# EasyEDA Pro project rp.eprj

# Schematic Schematic1
Board Name: Board1; Create Date: 2026-03-16; Page Name: P1; Project Name: rp; Schematic Name: Schematic1; Update Date: 2026-03-19; Company: EasyEDA.com; Page Size: A4; Version: V1.0
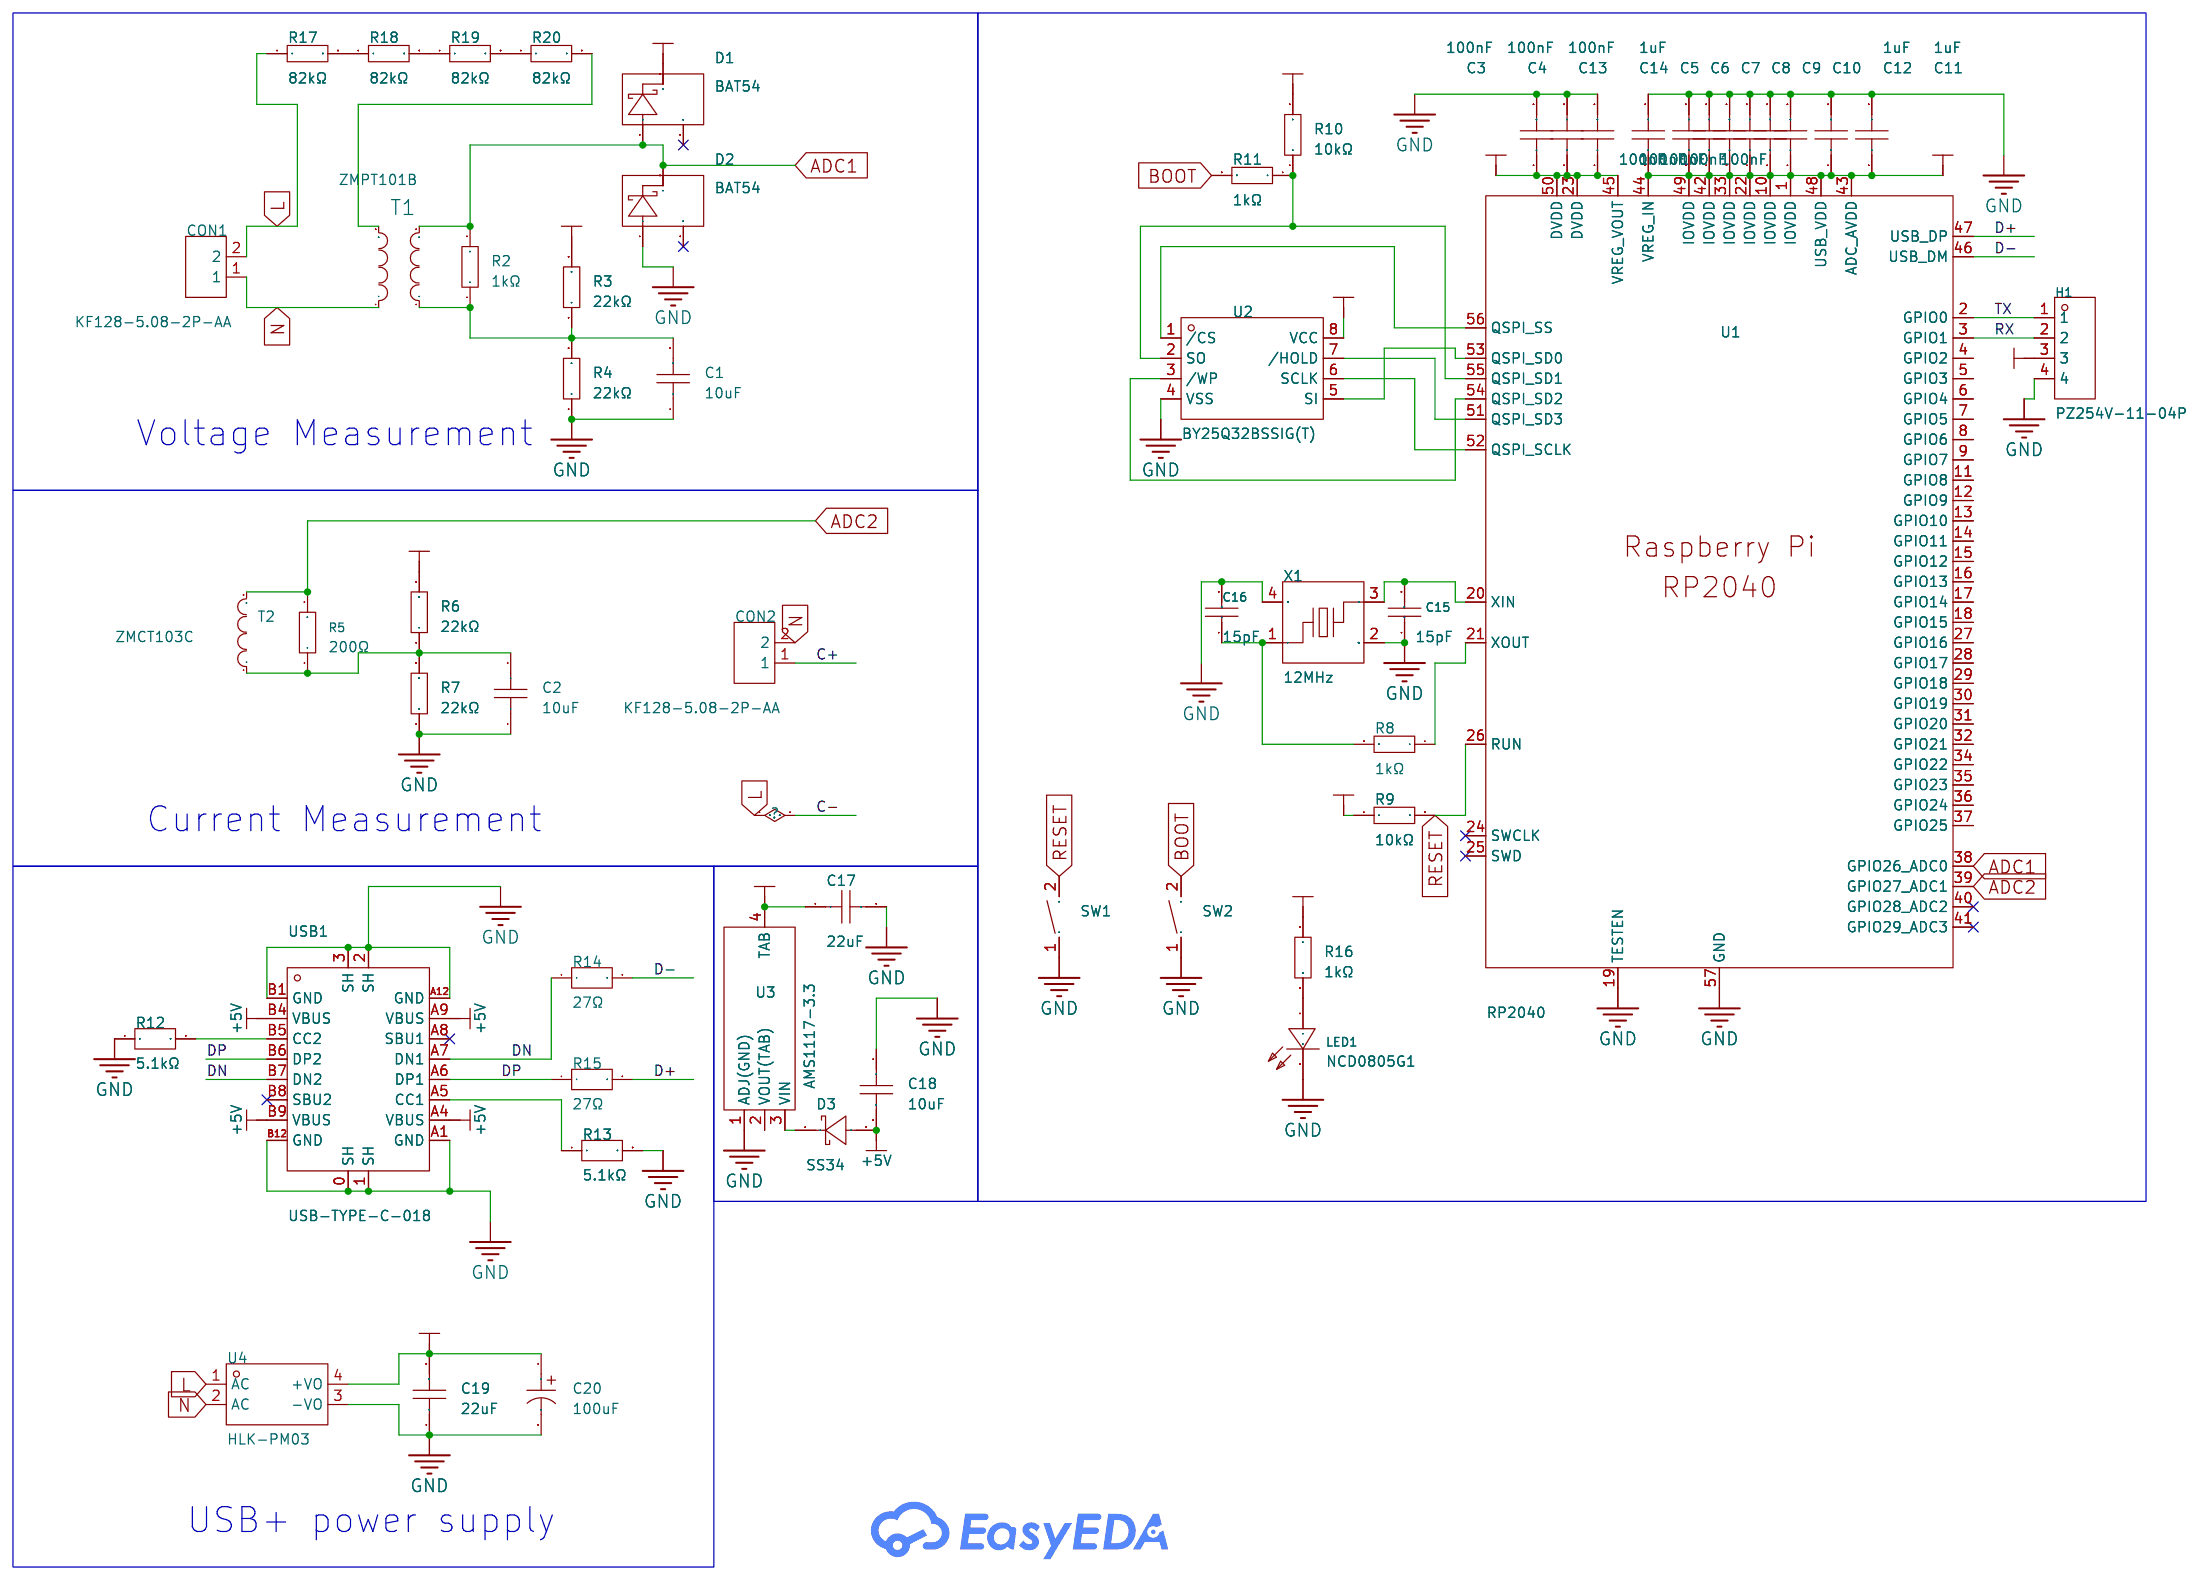
[diagram p0: schematic sheet]

## Parts
C1  10uF  [C0805]
C2  10uF  [C0805]
C3  100nF  [C0603]
C4  100nF  [C0603]
C5  100nF  [C0603]
C6  100nF  [C0603]
C7  100nF  [C0603]
C8  100nF  [C0603]
C9  100nF  [C0603]
C10  100nF  [C0603]
C11  1uF  [C0603]
C12  1uF  [C0603]
C13  100nF  [C0603]
C14  1uF  [C0603]
C15  15pF  [C0603]
C16  15pF  [C0603]
C17  22uF  [C0805]
C18  10uF  [C0805]
C19  22uF  [C0805]
C20  100uF  [CAP-SMD_BD6.3-L6.6-W6.6-LS7.2-FD-1]
CON1  KF128-5.08-2P-AA  [CONN-TH_P5.08_KF128-5.08-2P]
CON2  KF128-5.08-2P-AA  [CONN-TH_P5.08_KF128-5.08-2P]
D1  BAT54  [SOT-23-3_L2.9-W1.4-P1.90-LS2.5-BR]
D2  BAT54  [SOT-23-3_L2.9-W1.4-P1.90-LS2.5-BR]
D3  SS34  [SMA-SMD_L4.4-W2.7-LS5.4-RD]
H1  PZ254V-11-04P  [HDR-TH_4P-P2.54-V-M]
LED1  NCD0805G1  [LED0805-R-RD]
R2  1kΩ  [R0603]
R3  22kΩ  [R0603]
R4  22kΩ  [R0603]
R5  200Ω  [R0805]
R6  22kΩ  [R0603]
R7  22kΩ  [R0603]
R8  1kΩ  [R0603]
R9  10kΩ  [R0603]
R10  10kΩ  [R0603]
R11  1kΩ  [R0603]
R12  5.1kΩ  [R0603]
R13  5.1kΩ  [R0603]
R14  27Ω  [R0603]
R15  27Ω  [R0603]
R16  1kΩ  [R0603]
R17  82kΩ  [R0805]
R18  82kΩ  [R0805]
R19  82kΩ  [R0805]
R20  82kΩ  [R0805]
SW1  HX 3x4x2-2P-1.6N TACTILE SWITCH  [KEY-SMD_L4.0-W3.0-LS4.9-1]
SW2  HX 3x4x2-2P-1.6N TACTILE SWITCH  [KEY-SMD_L4.0-W3.0-LS4.9-1]
T1  ZMPT101B  [XFMR-TH_ZMPT101B]
T2  ZMCT103C  [XFMR-TH_ZMCT103C]
U1  RP2040  [LQFN-56_L7.0-W7.0-P0.4-EP]
U2  BY25Q32BSSIG(T)  [SOP-8_L5.3-W5.3-P1.27-LS8.0-BL]
U3  AMS1117-3.3  [SOT-223-4_L6.5-W3.5-P2.30-LS7.0-BR]
U4  HLK-PM03  [PWRM-TH_HLK-PM03]
USB1  USB-TYPE-C-018  [USB-C_SMD-TYPE-C-31-M-12]
X1  12MHz  [CRYSTAL-SMD_4P-L3.2-W2.5-BL]

## Library data of the parts
C1 C2 C18 = GRM21BR61H106KE43L: LCSC Part Name: 10uF ±10% 50V; Supplier Part: C440198; Manufacturer: muRata(村田); Supplier Footprint: 0805; JLCPCB Part Class: Basic Part; Datasheet: https://item.szlcsc.com/datasheet/GRM21BR61H106KE43L/439567.html; Supplier: LCSC; Tolerance: ±10%; Voltage Rating: 50V; Temperature Coefficient: X5R
C3-C10 C13 = CC0603KRX7R9BB104: LCSC Part Name: 100nF ±10% 50V; Supplier Part: C14663; Manufacturer: YAGEO(国巨); Supplier Footprint: 0603; JLCPCB Part Class: Basic Part; Datasheet: https://item.szlcsc.com/datasheet/CC0603KRX7R9BB104/15331.html; Supplier: LCSC; Tolerance: ±10%; Voltage Rating: 50V; Temperature Coefficient: X7R
C11 C12 C14 = CL10A105KB8NNNC: LCSC Part Name: 1uF ±10% 50V; Supplier Part: C15849; Manufacturer: SAMSUNG(三星); Supplier Footprint: 0603; JLCPCB Part Class: Basic Part; Datasheet: https://item.szlcsc.com/datasheet/CL10A105KB8NNNC/16531.html; Supplier: LCSC; Tolerance: ±10%; Voltage Rating: 50V; Temperature Coefficient: X5R
C15 C16 = CC0603JRNPO9BN150: LCSC Part Name: 15pF ±5% 50V; Supplier Part: C107037; Manufacturer: YAGEO(国巨); Supplier Footprint: 0603; JLCPCB Part Class: Extended Part; Datasheet: https://item.szlcsc.com/datasheet/CC0603JRNPO9BN150/108253.html; Supplier: LCSC; Tolerance: ±5%; Voltage Rating: 50V; Temperature Coefficient: NP0
C17 C19 = CL21A226MAYNNNE: LCSC Part Name: 22uF ±20% 25V; Supplier Part: C602037; Manufacturer: SAMSUNG(三星); Supplier Footprint: 0805; JLCPCB Part Class: Extended Part; Datasheet: https://item.szlcsc.com/datasheet/CL21A226MAYNNNE/631473.html; Supplier: LCSC; Tolerance: ±20%; Voltage Rating: 25V; Temperature Coefficient: X5R
C20 = RVT1E101M0607 100UF 25V: LCSC Part Name: 100uF ±20% 25V; Supplier Part: C970685; Manufacturer: DMBJ(振宝佳); Supplier Footprint: SMD,D6.3xL7.7mm; JLCPCB Part Class: Extended Part; Datasheet: https://item.szlcsc.com/datasheet/RVT1E101M0607%2520100UF%252025V/1060413.html; Supplier: LCSC; Tolerance: ±20%; Voltage Rating: 25V; Ripple Current: 93mA@120Hz; Diameter: 6.3mm; Height - Seated (Max): 7.7mm; Lifetime: 2800hrs@105℃; Operating Temperature: -55℃~+105℃
CON1 CON2 = KF128-5.08-2P-AA: LCSC Part Name: 5.08mm 1x2P 排数:1 每排P数:2 直插; Supplier Part: C474952; Manufacturer: KEFA(科发); Supplier Footprint: 插件,P=5.08mm; JLCPCB Part Class: Extended Part; Datasheet: https://item.szlcsc.com/datasheet/KF128-5.08-2P-AA/481570.html; Supplier: LCSC; Number of Positions or Pins: 1x2P; Pitch: 5.08mm; Color: Green; Mounting Type: Straight; Number of Pins: 2P; Number of Rows: 1; Number of PINs Per Row: 2; Current Rating: 24A; Voltage Rating (Max): 250V; Wire Gauge - AWG: 12~22; Wire Gauge - mm2: 2.5; Operating Temperature: -40℃~+105℃
D1 D2 = BAT54_C22466368: LCSC Part Name: 电压:30V 电流:0.2A; Supplier Part: C22466368; Manufacturer: R+O(宏嘉诚); Supplier Footprint: SOT-23; JLCPCB Part Class: Extended Part; Datasheet: https://item.szlcsc.com/datasheet/BAT54/24165527.html; Supplier: LCSC; Diode Configuration: Independent; Voltage - Forward(Vf@If): 1V@100mA; Voltage - DC Reverse(Vr): 30V; Current - Rectified: 200mA; Reverse Leakage Current (Ir): 2uA@25V; Non-Repetitive Peak Forward Surge Current: 600mA
D3 = SS34_C22448055: LCSC Part Name: 电压:40V 电流:3A; Supplier Part: C22448055; Manufacturer: XUMAO(旭茂微); Supplier Footprint: SMA; JLCPCB Part Class: Extended Part; Datasheet: https://item.szlcsc.com/datasheet/SS34/24106939.html; Supplier: LCSC; Voltage - Forward(Vf@If): 550mV@3A; Voltage - DC Reverse(Vr): 40V; Current - Rectified: 3A; Reverse Leakage Current (Ir): 100uA@40V; Operating Junction Temperature Range: -55℃~+150℃
H1 = PZ254V-11-04P: LCSC Part Name: 1x4P 间距:2.54mm 方针 直插; Supplier Part: C2691448; Manufacturer: XFCN(兴飞); Supplier Footprint: 插件,P=2.54mm; JLCPCB Part Class: Extended Part; Datasheet: https://item.szlcsc.com/datasheet/PZ254V-11-04P/2801085.html; Supplier: LCSC; Pin Structure: 1x4P; Pitch: 2.54mm; Circluar Pins/Square Pins: Pin Header; Mounting Type: Through Hole; Number of Rows: 1; Number of Pins: 4P; Current Rating: 3A; Voltage Rating (Max): 250V; Length of Mating Pin: 6mm; Insulation Height: 2.5mm; Length of End Connection Pin: 3mm; Operating Temperature: -40℃~+105℃; Color: Black
LED1 = NCD0805G1: LCSC Part Name: 片式发光二极管; Supplier Part: C84260; Manufacturer: 国星光电; Supplier Footprint: 0805; JLCPCB Part Class: Extended Part; Datasheet: https://item.szlcsc.com/datasheet/NCD0805G1/85429.html; Supplier: LCSC; Illumination Color: Green; Voltage - Forward(Vf): 2.5V~3.6V; Power(Watts): 72mW; Forward Current: 20mA; Wavelength - Dominant: 525nm~537.5nm; Peak Wavelength: 520nm; Diode Configuration: Discrete Diode; Luminous Intensity: 400mcd; Viewing Angle: 130°; Operating Temperature: -30℃~+85℃
R2 R8 R11 R16 = RC0603FR-071KL: LCSC Part Name: 厚膜电阻 1kΩ ±1% 100mW; Supplier Part: C22548; Manufacturer: YAGEO(国巨); Supplier Footprint: 0603; JLCPCB Part Class: Extended Part; Datasheet: https://item.szlcsc.com/datasheet/RC0603FR-071KL/23274.html; Supplier: LCSC; Type: Thick Film Resistor; Tolerance: ±1%; Power(Watts): 100mW; Voltage-Supply(Max): 75V; Temperature Coefficient: ±100ppm/℃; Operating Temperature: -55℃~+155℃
R3 R4 R6 R7 = RC0603FR-0722KL: LCSC Part Name: 厚膜电阻 22kΩ ±1% 100mW; Supplier Part: C114065; Manufacturer: YAGEO(国巨); Supplier Footprint: 0603; JLCPCB Part Class: Extended Part; Datasheet: https://item.szlcsc.com/datasheet/RC0603FR-0722KL/115304.html; Supplier: LCSC; Type: Thick Film Resistor; Tolerance: ±1%; Power(Watts): 100mW; Voltage-Supply(Max): 75V; Temperature Coefficient: ±100ppm/℃; Operating Temperature: -55℃~+155℃
R5 = 0805W8F2000T5E: LCSC Part Name: 200Ω ±1% 125mW 厚膜电阻; Supplier Part: C17540; Manufacturer: UNI-ROYAL(厚声); Supplier Footprint: 0805; JLCPCB Part Class: Basic Part; Datasheet: https://item.szlcsc.com/datasheet/0805W8F2000T5E/18228.html; Supplier: LCSC; Type: Thick Film Resistor; Tolerance: ±1%; Power(Watts): 125mW; Voltage-Supply(Max): 150V; Temperature Coefficient: ±100ppm/℃; Operating Temperature: -55℃~+155℃
R9 R10 = RC0603FR-0710KL: LCSC Part Name: 厚膜电阻 10kΩ ±1% 100mW; Supplier Part: C98220; Manufacturer: YAGEO(国巨); Supplier Footprint: 0603; JLCPCB Part Class: Extended Part; Datasheet: https://atta.szlcsc.com/upload/public/pdf/source/20180927/C295883_E8D83085EA81BD7DE0B2B681138C15EE.pdf; Supplier: LCSC; Type: Thick Film Resistors; Tolerance: ±1%; Temperature Coefficient: ±100ppm/℃; Operating Temperature Range: -55℃~+155℃
R12 R13 = FRC0603F5101TS: LCSC Part Name: 5.1kΩ ±1% 100mW 厚膜电阻; Supplier Part: C2907044; Manufacturer: FOJAN(富捷); Supplier Footprint: 0603; JLCPCB Part Class: Extended Part; Supplier: LCSC; Type: Thick Film Resistor; Tolerance: ±1%; Power(Watts): 100mW; Voltage-Supply(Max): 75V; Temperature Coefficient: ±100ppm/℃; Operating Temperature: -55℃~+155℃
R14 R15 = FRC0603F27R0TS: LCSC Part Name: 27Ω ±1% 100mW 厚膜电阻; Supplier Part: C2907021; Manufacturer: FOJAN(富捷); Supplier Footprint: 0603; JLCPCB Part Class: Extended Part; Supplier: LCSC; Type: Thick Film Resistor; Tolerance: ±1%; Power(Watts): 100mW; Voltage-Supply(Max): 75V; Temperature Coefficient: ±100ppm/℃; Operating Temperature: -55℃~+155℃
R17-R20 = 0805W8F8202T5E: LCSC Part Name: 82kΩ ±1% 125mW 厚膜电阻; Supplier Part: C17840; Manufacturer: UNI-ROYAL(厚声); Supplier Footprint: 0805; JLCPCB Part Class: Extended Part; Datasheet: https://item.szlcsc.com/datasheet/0805W8F8202T5E/18528.html; Supplier: LCSC; Type: Thick Film Resistor; Tolerance: ±1%; Power(Watts): 125mW; Voltage-Supply(Max): 150V; Temperature Coefficient: ±100ppm/℃; Operating Temperature: -55℃~+155℃
SW1 SW2 = HX 3x4x2-2P-1.6N TACTILE SWITCH: LCSC Part Name: 4*3*2mm 立贴 轻触开关; Supplier Part: C49234124; Manufacturer: hanxia(韩下); Supplier Footprint: SMD; JLCPCB Part Class: Extended Part; Datasheet: https://item.szlcsc.com/datasheet/HX%25203x4x2-2P-1.6N%2520TACTILE%2520SWITCH/51650185.html; Supplier: LCSC; Circuit: SPST; Actuator Style: Round Button; Operating Force: 1.6N; Mounting Type: Surface Mount,Vertical; Length: 4mm; Width: 3mm; Switch Height: 2mm; with Bracket: Without Bracket; Contact Current: 50mA; Voltage Rating: 12V; Actuator/Cap Color: Black; With Lamp: No; Termination Style: SMD(SMT) Tab; Life: 100,000 Cycles
T1 = ZMPT101B: Supplier Part: C111858; Manufacturer: 择明朗熙; Supplier Footprint: 插件; JLCPCB Part Class: Extended Part; Datasheet: https://item.szlcsc.com/datasheet/ZMPT101B/113087.html; Supplier: LCSC
T2 = ZMCT103C: LCSC Part Name: 蓝色 A类 精密电流互感器; Supplier Part: C94571; Manufacturer: 择明朗熙; Supplier Footprint: 插件; JLCPCB Part Class: Extended Part; Datasheet: https://item.szlcsc.com/datasheet/ZMCT103C/95769.html; Supplier: LCSC; Type: Current Transformer; Turns Ratio: 1000:1; Rated input Current: 5A; Rated Output Current: 5mA; Linearity: 0.2%; Isolation Voltage(Vrms): 4.5kV
U1 = RP2040_C2040: LCSC Part Name: RP2040（RP2B2）; Supplier Part: C2040; Manufacturer: Raspberry Pi(树莓派); Supplier Footprint: LQFN-56(7x7); JLCPCB Part Class: Extended Part; Datasheet: https://item.szlcsc.com/datasheet/RP2040/2392.html; Supplier: LCSC; CPU Maximum Speed: 133MHz; Number of I/O: 30; ADC (Bit): 12bit
U2 = BY25Q32BSSIG(T): LCSC Part Name: 停产 32Mbit SPI NOR闪存; Supplier Part: C428875; Manufacturer: BOYAMICRO(博雅); Supplier Footprint: SOP-8-208mil; JLCPCB Part Class: Extended Part; Datasheet: https://item.szlcsc.com/datasheet/BY25Q32BSSIG(T)/424013.html; Supplier: LCSC; Interface: SPI; Memory Size: 32Mbit; Clock Frequency: 120MHz; Voltage - Supply: 2.7V~3.6V; Standby Supply Current: 5uA; Program / Erase Cycles: 100,000 Cycles; Page Programming Time (Tpp): 600us; Block Erase Time(tBE): 150ms@(32KB); Data Retention - TDR (Year): 20 Years; Operating Temperature: -40℃~+85℃
U3 = AMS1117-3.3_C347222: LCSC Part Name: 3.3V 1A 12V; Supplier Part: C347222; Manufacturer: UMW(友台半导体); Supplier Footprint: SOT-223; JLCPCB Part Class: Extended Part; Datasheet: https://item.szlcsc.com/datasheet/AMS1117-3.3/323882.html; Supplier: LCSC; Output Type: Fixed; Voltage - Supply: 12V; Output Voltage: 3.3V; Output Current: 1A; Power Supply Rejection Ratio (PSRR): 60dB@(120Hz); Voltage Dropout: 1.3V@(1A); standby current: 5mA; Noise: 0.003%Vout; Features: Over Current Protection; Operating Temperature: -40℃~+125℃; Output Configuration: Positive; Number of Outputs: 1
U4 = HLK-PM03: Supplier Part: C209904; Manufacturer: HI-LINK(海凌科); Supplier Footprint: 插件; JLCPCB Part Class: Extended Part; Datasheet: https://atta.szlcsc.com/upload/public/pdf/source/20231009/A2CB2EF6B3F7CFD4452AD83E39216571.pdf; Supplier: LCSC; Conversion Type: AC-DC; Input Voltage(DC): 120V~350V; Output Voltage: 3.3V; Output Power: 3W; Input Voltage(AC): 90VAC~265VAC; Output Current (Max): 1A; Function: Step-down type; Output Channel: 1; Insulated Voltage: 3kV@AC; Conversion Efficiency: 72%; Feature: Overcurrent Protection；Short-Circuit Protection
USB1 = USB-TYPE-C-018: LCSC Part Name: Type-C 母 卧贴; Supplier Part: C2927038; Manufacturer: DEALON(德艺隆); Supplier Footprint: SMD; JLCPCB Part Class: Extended Part; Datasheet: https://item.szlcsc.com/datasheet/USB-TYPE-C-018/3252507.html; Supplier: LCSC; Connector Type: Type-C; Gender: Female; Mounting Type: Surface Mount, Right Angle; Number of Contacts: 16P; Number of Ports: 1; Current Rating-Power: 3A; Voltage Rating: 5V; Connect-Disconnect Life: 10,000 cycles; Length: 7.35mm; Operating Temperature: -25℃~+85℃
X1 = XL2EL89CSI-111YLC-12M: LCSC Part Name: YSX321SL 12MHZ 4P 3225 20PF ±10PPM -40~85℃ (±20PPM); Supplier Part: C5280576; Manufacturer: YXC(扬兴晶振); Supplier Footprint: SMD3225-4P; JLCPCB Part Class: Extended Part; Datasheet: https://item.szlcsc.com/datasheet/XL2EL89CSI-111YLC-12M/6016758.html; Supplier: LCSC; Type: Crystal Oscillator; Normal temperature Frequency Tolerance: ±10ppm; Load Capacitance: 20pF; Frequency Stability: ±20ppm; Operating Temperature: -40℃~+85℃

## Nets
1.1V: C3.1 C4.1 C13.1 U1.23(DVDD) U1.45(VREG_VOUT) U1.50(DVDD)
3.3V: C5.1 C6.1 C7.1 C8.1 C9.1 C10.1 C11.1 C12.1 C14.1 C17.1 C19.2 C20.1 D1.3(K) H1.3 R3.2 R6.2 R9.1 R10.2 R16.1 U1.1(IOVDD) U1.10(IOVDD) U1.22(IOVDD) U1.33(IOVDD) U1.42(IOVDD) U1.43(ADC_AVDD) U1.44(VREG_IN) U1.48(USB_VDD) U1.49(IOVDD) U2.8(VCC) U3.4(TAB) U4.4(+VO)
+5V: C18.2 D3.2(A) USB1.A4(VBUS) USB1.A9(VBUS) USB1.B4(VBUS) USB1.B9(VBUS)
GND: C1.1 C2.1 C3.2 C4.2 C5.2 C6.2 C7.2 C8.2 C9.2 C10.2 C11.2 C12.2 C13.2 C14.2 C15.1 C16.2 C17.2 C18.1 C19.1 C20.2 D2.1(A) H1.4 LED1.2(K) R4.1 R7.1 R12.1 R13.2 SW1.1 SW2.1 U1.19(TESTEN) U1.57(GND) U2.4(VSS) U3.1(ADJ(GND)) U4.3(-VO) USB1.0(SH) USB1.1(SH) USB1.2(SH) USB1.3(SH) USB1.A1(GND) USB1.A12(GND) USB1.B1(GND) USB1.B12(GND) X1.2(GND) X1.4(GND)
ADC1: D1.1(A) D2.3(K) R2.2 T1.2 U1.38(GPIO26_ADC0)
ADC2: R5.2 T2.2 U1.39(GPIO27_ADC1)
BOOT: R11.2 SW2.2
C+: CON2.1
C-: CON1.2 R17.1 U4.1(AC)
D+: R15.2 U1.47(USB_DP)
D-: R14.2 U1.46(USB_DM)
DN: R14.1 USB1.A7(DN1) USB1.B7(DN2)
DP: R15.1 USB1.A6(DP1) USB1.B6(DP2)
N: CON1.1 CON2.2 T1.4 U4.2(AC)
RESET: R9.2 SW1.2 U1.26(RUN)
RX: H1.2 U1.3(GPIO1)
TX: H1.1 U1.2(GPIO0)
$1N2110: C1.2 R2.1 R3.1 R4.2 T1.1
$1N2168: C2.2 R5.1 R6.1 R7.2 T2.1
$1N2640: R20.2 T1.3
$1N4344: U1.52(QSPI_SCLK) U2.6(SCLK)
$1N4350: U1.56(QSPI_SS) U2.1(/CS)
$1N4357: U1.51(QSPI_SD3) U2.7(/HOLD)
$1N4376: U1.53(QSPI_SD0) U2.5(SI)
$1N4384: R10.1 R11.1 U1.55(QSPI_SD1) U2.2(SO)
$1N4395: U1.54(QSPI_SD2) U2.3(/WP)
$1N5832: C15.2 U1.20(XIN) X1.3
$1N5887: C16.1 R8.2 X1.1
$1N5892: R8.1 U1.21(XOUT)
$1N6778: R12.2 USB1.B5(CC2)
$1N6817: R13.1 USB1.A5(CC1)
$1N7231: D3.1(K) U3.3(VIN)
$1N11564: LED1.1(A) R16.2
$1N14955: R17.2 R18.1
$1N14994: R18.2 R19.1
$1N15033: R19.2 R20.1

Not connected (* = marked no-connect by the designer): D1 2*; D2 2*; U1 4(GPIO2) 5(GPIO3) 6(GPIO4) 7(GPIO5) 8(GPIO6) 9(GPIO7) 11(GPIO8) 12(GPIO9) 13(GPIO10) 14(GPIO11) 15(GPIO12) 16(GPIO13) 17(GPIO14) 18(GPIO15) 24(SWCLK)* 25(SWD)* 27(GPIO16) 28(GPIO17) 29(GPIO18) 30(GPIO19) 31(GPIO20) 32(GPIO21) 34(GPIO22) 35(GPIO23) 36(GPIO24) 37(GPIO25) 40(GPIO28_ADC2)* 41(GPIO29_ADC3)*; U3 2(VOUT(TAB)); USB1 A8(SBU1)* B8(SBU2)*

## Notes on the sheet
- Voltage Measurement
- Current Measurement
- USB+ power supply

# Board PCB1
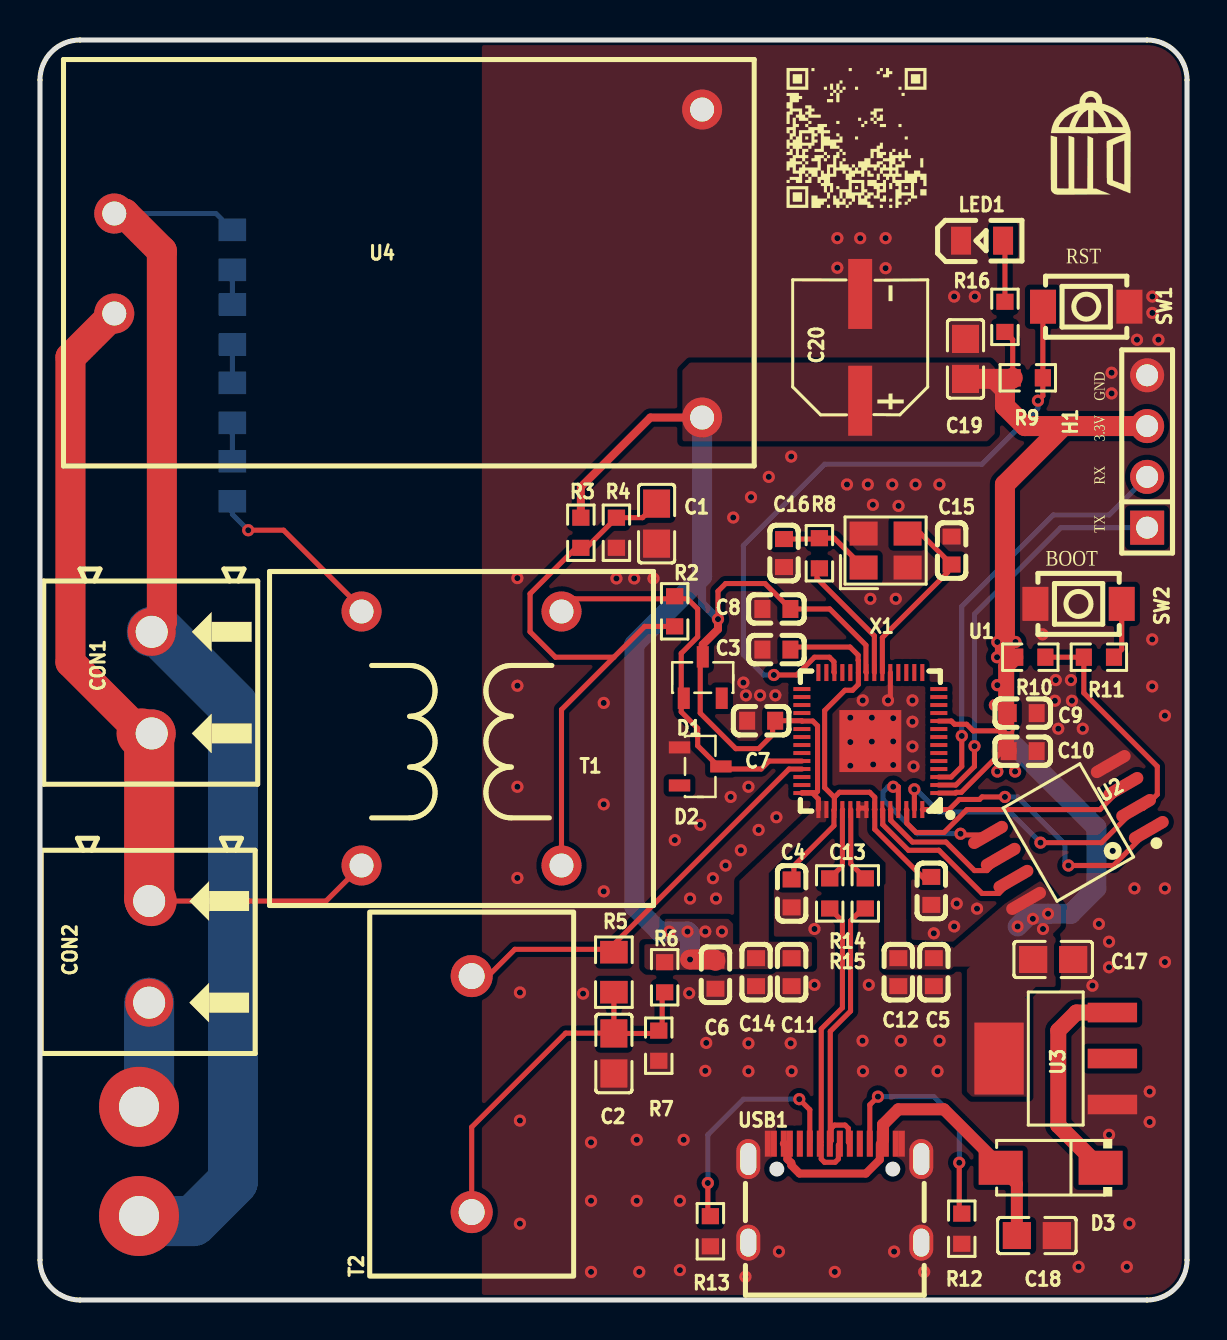
[diagram p1: board, top side]
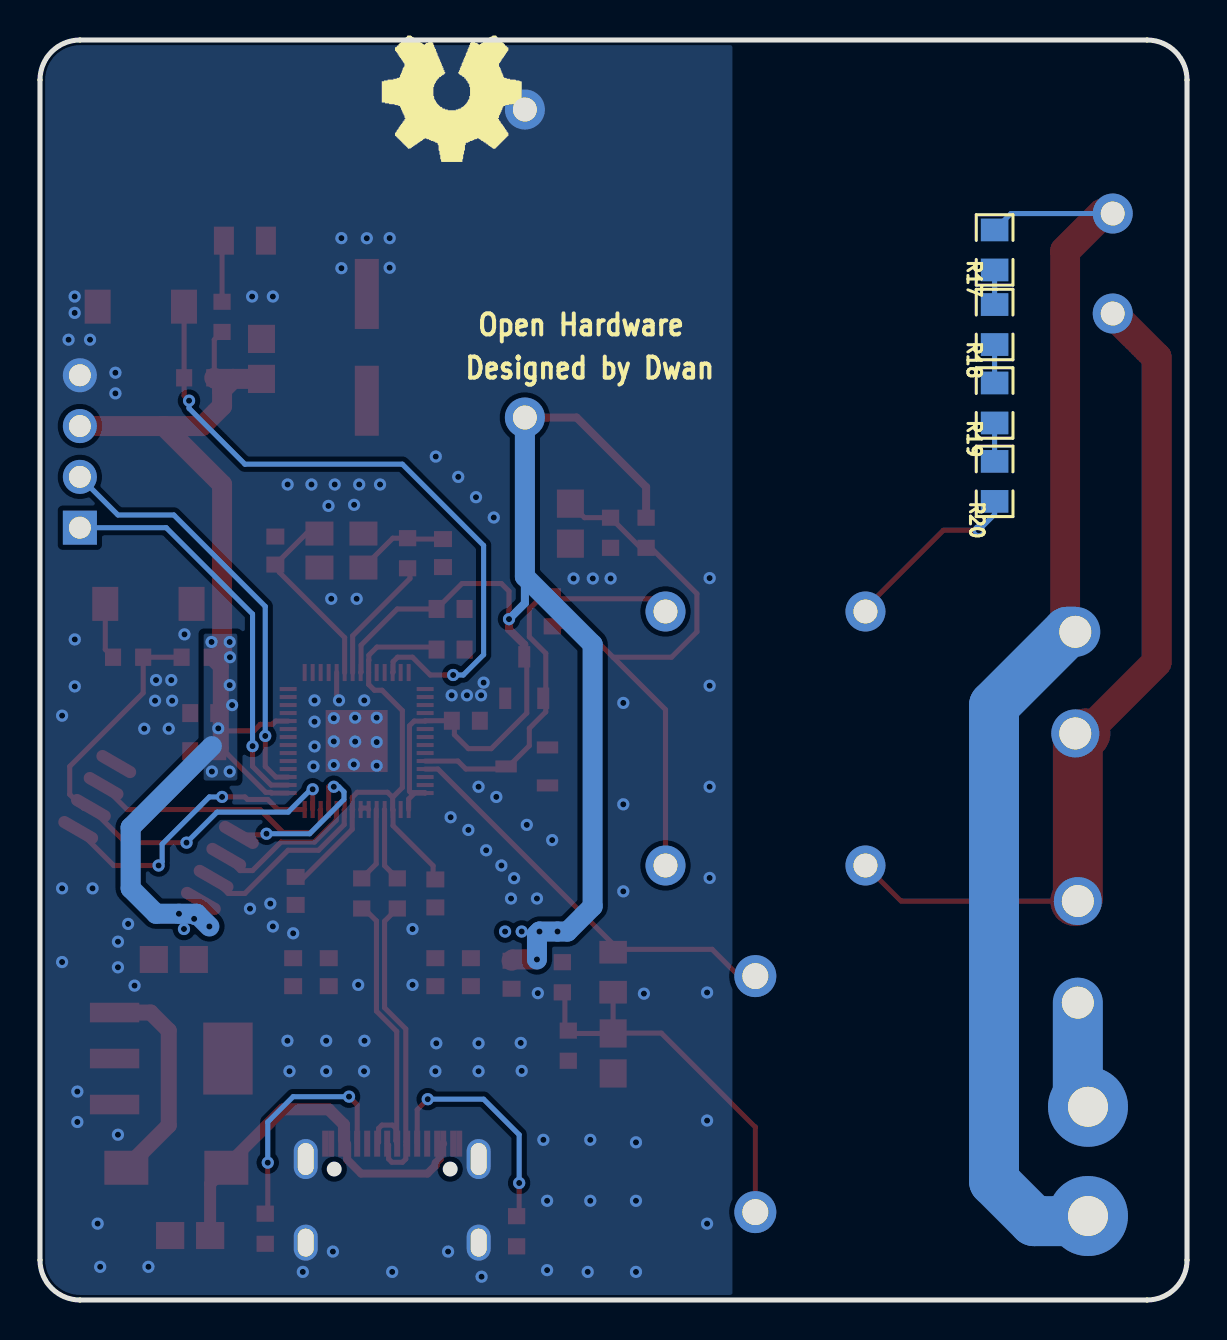
[diagram p2: board, bottom side, seen from below]

Outline 57.37 x 63 mm; copper layers: Top Layer, Bottom Layer. Coordinates in mm from the lower left corner of the outline.
Outline path: 0,61 0,2 arc(0.59,0.59) 2,0 55.37,0 arc(56.78,0.59) 57.37,2 57.37,61 arc(56.78,62.41) 55.37,63 2,63 arc(0.59,62.41) 0,61
Stack: Top Layer 0.035mm / Dielectric1 1.51mm FR4 er 4.5 / Bottom Layer 0.035mm

## Design rules (mm)
net D-: DP2
net DN: DP1
net D+: DP2
net DP: DP1
template: Custom Config
spacing copperThickness1oz (default): track to track 0.102, other pairs 0.152 to 0.3
spacing copperThickness2oz: track to track 0.203, other pairs 0.152 to 0.3
track width copperThickness1oz (default): min 0.127, default 0.254, max 2.54
track width copperThickness2oz: min 0.203, default 0.254, max 2.54
differential pair differentialPair (default): width min 0.127, default 0.254, max 2.54; gap min 0.152, default 0.152
via viaSize (default): diameter min 0.5, default 0.61, max 10; hole min 0.3, default 0.305, max 6.3
net GND uses copperRegion1
net 3.3V uses copperRegion1

## Placement (name value [footprint] x y rotation side)
C1  10uF  [C0805]  30.84 38.82 90 top
C2  10uF  [C0805]  28.7 12.33 90 top
C3  100nF  [C0603]  36.83 32.52 180 top
C4  100nF  [C0603]  37.59 20.33 270 top
C5  100nF  [C0603]  44.7 16.39 270 top
C6  100nF  [C0603]  33.78 16.26 270 top
C7  100nF  [C0603]  36.07 28.96 180 top
C8  100nF  [C0603]  36.83 34.55 180 top
C9  100nF  [C0603]  49.15 29.35 0 top
C10  100nF  [C0603]  49.15 27.44 0 top
C11  1uF  [C0603]  37.59 16.39 270 top
C12  1uF  [C0603]  42.93 16.39 270 top
C13  100nF  [C0603]  44.58 20.46 270 top
C14  1uF  [C0603]  35.81 16.39 270 top
C15  15pF  [C0603]  45.59 37.47 270 top
C16  15pF  [C0603]  37.21 37.35 270 top
C17  22uF  [C0805]  50.67 17.03 0 top
C18  10uF  [C0805]  49.86 3.22 180 top
C19  22uF  [C0805]  46.29 47.06 270 top
C20  100uF  [CAP-SMD_BD6.3-L6.6-W6.6-LS7.2-FD-1]  41.02 47.63 90 top
CON1  KF128-5.08-2P-AA  [CONN-TH_P5.08_KF128-5.08-2P]  5.59 30.87 90 top
CON2  KF128-5.08-2P-AA  [CONN-TH_P5.08_KF128-5.08-2P]  5.46 17.41 90 top
D1  BAT54  [SOT-23-3_L2.9-W1.4-P1.90-LS2.5-BR]  33.15 31.12 270 top
D2  BAT54  [SOT-23-3_L2.9-W1.4-P1.90-LS2.5-BR]  33.02 26.68 180 top
D3  SS34  [SMA-SMD_L4.4-W2.7-LS5.4-RD]  50.55 6.61 180 top
H1  PZ254V-11-04P  [HDR-TH_4P-P2.54-V-M]  55.37 42.43 90 top
LED1  NCD0805G1  [LED0805-R-RD]  47.12 52.97 0 top
NOREF  -  [Pad_e53]  4.95 9.66 0 top
NOREF#2  -  [Pad_e56]  4.95 4.2 0 top
R2  1kΩ  [R0603]  31.74 34.43 90 top
R3  22kΩ  [R0603]  27.05 38.36 90 top
R4  22kΩ  [R0603]  28.83 38.36 90 top
R5  200Ω  [R0805]  28.7 16.39 90 top
R6  22kΩ  [R0603]  31.24 16.14 90 top
R7  22kΩ  [R0603]  30.95 12.72 90 top
R8  1kΩ  [R0603]  38.98 37.34 90 top
R9  10kΩ  [R0603]  49.4 46.11 0 top
R10  10kΩ  [R0603]  49.53 32.14 180 top
R11  1kΩ  [R0603]  52.96 32.14 0 top
R12  5.1kΩ  [R0603]  46.1 3.56 90 top
R13  5.1kΩ  [R0603]  33.53 3.44 270 top
R14  27Ω  [R0603]  39.5 20.33 90 top
R15  27Ω  [R0603]  41.27 20.33 90 top
R16  1kΩ  [R0603]  48.26 49.16 90 top
R17  82kΩ  [R0805]  9.62 52.5 270 bottom
R18  82kΩ  [R0805]  9.62 48.77 270 bottom
R19  82kΩ  [R0805]  9.62 44.85 270 bottom
R20  82kΩ  [R0805]  9.62 40.93 270 bottom
SW1  HX 3x4x2-2P-1.6N TACTILE SWITCH  [KEY-SMD_L4.0-W3.0-LS4.9-1]  52.32 49.67 180 top
SW2  HX 3x4x2-2P-1.6N TACTILE SWITCH  [KEY-SMD_L4.0-W3.0-LS4.9-1]  51.94 34.81 0 top
T1  ZMPT101B  [XFMR-TH_ZMPT101B]  21.08 28.08 180 top
T2  ZMCT103C  [XFMR-TH_ZMCT103C]  21.59 10.3 90 top
U1  RP2040  [LQFN-56_L7.0-W7.0-P0.4-EP]  41.53 27.95 180 top
U2  BY25Q32BSSIG(T)  [SOP-8_L5.3-W5.3-P1.27-LS8.0-BL]  51.44 23.38 120 top
U3  AMS1117-3.3  [SOT-223-4_L6.5-W3.5-P2.30-LS7.0-BR]  50.8 12.07 0 top
U4  HLK-PM03  [PWRM-TH_HLK-PM03]  18.42 51.82 0 top
USB1  USB-TYPE-C-018  [USB-C_SMD-TYPE-C-31-M-12]  39.75 5.34 0 top
X1  12MHz  [CRYSTAL-SMD_4P-L3.2-W2.5-BL]  42.29 37.47 0 top

## Footprints (pads in the part's own frame, mm; a bottom-side part is the same pattern mirrored in y, then rotated)
C0603
  rect 0.8x0.9 smd: 1(-0.7,0) 2(0.7,0)
C0805
  rect 1.41x1.35 smd: 1(-1,0) 2(1,0)
CAP-SMD_BD6.3-L6.6-W6.6-LS7.2-FD-1
  rect 3.5x1.2 smd: 1(-2.67,0) 2(2.67,0)
CONN-TH_P5.08_KF128-5.08-2P
  round 2.4 hole 1.6: 1(-2.54,0) 2(2.54,0)
CRYSTAL-SMD_4P-L3.2-W2.5-BL
  rect 1.4x1.2 smd: 1(-1.1,-0.85) 2(1.1,-0.85) 3(1.1,0.85) 4(-1.1,0.85)
HDR-TH_4P-P2.54-V-M
  rect 1.7x1.7 hole 1.1: 1(-3.81,0)
  round 1.7 hole 1.1: 2(-1.27,0) 3(1.27,0) 4(3.81,0)
KEY-SMD_L4.0-W3.0-LS4.9-1
  rect 1.3x1.7 smd: 1(-2.159,0) 2(2.159,0)
LED0805-R-RD
  rect 1x1.399 smd: 1(1.05,0) 2(-1.05,0)
LQFN-56_L7.0-W7.0-P0.4-EP
  rect 0.85x0.2 smd: 1(-3.425,2.6) 2(-3.425,2.2) 3(-3.425,1.8) 4(-3.425,1.4) 5(-3.425,1) 6(-3.425,0.6) 7(-3.425,0.2) 8(-3.425,-0.2) 9(-3.425,-0.6) 10(-3.425,-1) 11(-3.425,-1.4) 12(-3.425,-1.8) 13(-3.425,-2.2) 14(-3.425,-2.6) 29(3.425,-2.6) 30(3.425,-2.2) 31(3.425,-1.8) 32(3.425,-1.4) 33(3.425,-1) 34(3.425,-0.6) 35(3.425,-0.2) 36(3.425,0.2) 37(3.425,0.6) 38(3.425,1) 39(3.425,1.4) 40(3.425,1.8) 41(3.425,2.2) 42(3.425,2.6)
  rect 0.2x0.85 smd: 15(-2.6,-3.425) 16(-2.2,-3.425) 17(-1.8,-3.425) 18(-1.4,-3.425) 19(-1,-3.425) 20(-0.6,-3.425) 21(-0.2,-3.425) 22(0.2,-3.425) 23(0.6,-3.425) 24(1,-3.425) 25(1.4,-3.425) 26(1.8,-3.425) 27(2.2,-3.425) 28(2.6,-3.425) 43(2.6,3.425) 44(2.2,3.425) 45(1.8,3.425) 46(1.4,3.425) 47(1,3.425) 48(0.6,3.425) 49(0.2,3.425) 50(-0.2,3.425) 51(-0.6,3.425) 52(-1,3.425) 53(-1.4,3.425) 54(-1.8,3.425) 55(-2.2,3.425) 56(-2.6,3.425)
  rect 3.1x3.1 smd: 57(0,0)
Pad_e53
  round 4 hole 2: 1(0,0)
Pad_e56
  round 4 hole 2: 2(0,0)
PWRM-TH_HLK-PM03
  round 2 hole 1.2: 1(-14.7,2.5) 2(-14.7,-2.5) 3(14.7,7.7) 4(14.7,-7.7)
R0603
  rect 0.806x0.864 smd: 1(-0.753,0) 2(0.753,0)
R0805
  rect 1.133x1.377 smd: 1(-1,0) 2(1,0)
SMA-SMD_L4.4-W2.7-LS5.4-RD
  rect 2.2x1.7 smd: 1(-2.5,0) 2(2.5,0)
SOP-8_L5.3-W5.3-P1.27-LS8.0-BL
  oval 0.609x2.204 smd: 1(-1.905,-3.542) 2(-0.635,-3.542) 3(0.635,-3.542) 4(1.905,-3.542) 5(1.905,3.542) 6(0.635,3.542) 7(-0.635,3.542) 8(-1.905,3.542)
SOT-23-3_L2.9-W1.4-P1.90-LS2.5-BR
  rect 1.07x0.6 smd: 1(1.035,-0.95) 2(1.035,0.95) 3(-1.035,0)
SOT-223-4_L6.5-W3.5-P2.30-LS7.0-BR
  rect 2.47x0.98 smd: 1(2.835,-2.3) 2(2.835,0) 3(2.835,2.3)
  rect 2.47x3.6 smd: 4(-2.835,0)
USB-C_SMD-TYPE-C-31-M-12
  oval 1.2x2 hole 0.8x1.6: 0(-4.325,1.706) 1(4.325,1.706)
  oval 1.2x1.8 hole 0.8x1.4: 2(4.325,-2.474) 3(-4.325,-2.474)
  rect 0.3x1.3 smd: A1(-3.35,2.474) A4(-2.55,2.474) A5(-1.25,2.474) A6(-0.25,2.474) A7(0.25,2.474) A8(1.25,2.474) A9(2.55,2.474) A12(3.35,2.474) B1(3.05,2.474) B4(2.25,2.474) B5(1.75,2.474) B6(0.75,2.474) B7(-0.75,2.474) B8(-1.75,2.474) B9(-2.25,2.474) B12(-3.05,2.474)
XFMR-TH_ZMCT103C
  round 2.1 hole 1.3: 1(-5.9,0) 2(5.9,0)
XFMR-TH_ZMPT101B
  round 2 hole 1.2: 1(-5,6.35) 2(-5,-6.35) 3(5,-6.35) 4(5,6.35)

## Nets
As in the schematic, except:
C+: CON2.1 NOREF.1
C-: CON1.2 NOREF#2.2 R17.1 U4.1

Pads without a net: D1 2; D2 2; U1 4 5 6 7 8 9 11 12 13 14 15 16 17 18 24 25 27 28 29 30 31 32 34 35 36 37 40 41; U3 2; USB1 A8 B8

## Via types
v1: diameter 0.61, hole 0.305, Top Layer to Bottom Layer, 160 vias

## Routing (per net, layer and track width the routed paths; a pad name or vN(x,y) marks a point on that pad's centre or on a via; arc(x,y) is an arc through that point)
1.1V: length 24
  Top Layer w0.254: 37.71,21.46 37.71,21.71 39.71,23.71 39.71,24.5 U1.45 39.73,25.13 ; 44.58,21.04 44.25,21.04 41.75,23.54 41.75,24.5 U1.50 41.75,24.54 41.75,25.13 41.5,25.39 39.98,25.39 39.73,25.13 ; 39.73,25.13 39.24,25.62 39.24,29.47 40.26,30.49 40.64,30.49 40.93,30.78 U1.23 40.93,31.98 40.92,31.99 40.92,32.24 40.51,32.65 37.53,32.65
3.3V: length 126.4
  Top Layer w0.254: 44.95,28.95 45.58,28.95 45.74,28.79 46.34,28.79 46.67,28.46 48.32,28.46 ; U1.22 41.31,31.39 41.31,32.74 39.5,34.55 C8.1 36.26,35.82 34.29,35.82 33.91,35.44 v1(33.91,34.04) ; 44.95,25.35 45.79,25.35 45.83,25.38 46.08,25.38 48.01,27.31 48.32,27.31 ; R16.1 48.65,48.01 R9.1 ; U1.49 41.26,24.6 41,24.6 U1.48 ; 33.15,32.16 33.02,32.03 33.02,29.35 34.8,27.57 35.94,27.57 36.64,28.27 36.64,28.84 36.77,28.96 38.09,28.96 U1.33 38.65,28.95 38.89,28.71 38.89,25.43 38.82,25.37 38.13,25.37 U1.42 38.63,25.35 38.93,25.05 U1.43
  Top Layer w0.4: U4.4 30.53,44.12 27.05,40.65 R3.2 ; 33.15,32.16 33.15,32.77 33.91,33.54 v1(33.91,34.04)
  Top Layer w0.8: C10.1 48.32,27.57 48.32,31.68 R10.2
  Top Layer w1: 51.18,43.7 48.26,40.78 48.26,32.27 ; 51.18,43.7 H1.3 ; 51.18,43.7 49.26,43.7 48.26,44.7 48.26,45.51 47.72,46.06 ; C19.2 47.72,46.06 ; 47.72,46.06 48.6,46.06 R9.1 ; C6.1 33.72,17.03 v1(32.51,17.03)
  Bottom Layer w0.4: 33.11,36.17 33.11,34.84 v1(33.91,34.04)
  Bottom Layer w1: v1(48.89,18.68) 49.53,19.31 v1(50.42,19.31) 51.56,19.31 52.83,20.58 52.83,23.63 48.77,27.69 ; U4.4 33.11,36.17 29.73,32.78 29.73,19.68 30.98,18.42 v1(31.48,18.42) v1(32.39,18.42) 32.51,18.3 v1(32.51,17.03)
  vias: v1(33.27,18.42) v1(34.11,18.42) v1(47.76,29.75) v1(47.88,32.9) v1(47.87,32.14) v1(47.88,30.74) v1(47.88,26.42) v1(48.45,28.58) v1(48.79,32.9) v1(48.77,26.42) v1(49.66,19.06) v1(50.17,18.55)
+5V: length 18.9
  Top Layer w0.4: 42,7.82 42,7.02 41.3,6.32 37.99,6.32 37.58,6.73 37.58,6.85 37.38,7.05 37.38,7.64 37.2,7.81
  Top Layer w0.6: 42.16,7.98 42.16,8.77 42.93,9.53 45.21,9.53 48.05,6.7 D3.2 48.86,5.8 C18.2
GND: length 1.4
  Top Layer w0.254: U1.19 42.53,30.1 v1(42.41,29.98)
  vias: v1(23.88,36.1) v1(23.88,30.72) v1(23.88,25.66) v1(23.88,21.1) v1(24,15.38) v1(24,8.97) v1(24,3.81) v1(27.16,15.32) v1(27.56,7.88) v1(27.56,4.96) v1(27.56,1.41) v1(28.19,29.85) v1(28.19,24.78) v1(28.19,20.43) v1(28.83,36.08) v1(29.72,36.08) v1(29.85,8.01) v1(29.85,4.96) v1(29.97,1.41) v1(30.68,36.08) v1(31.75,23) v1(32,4.96) v1(32,1.49) v1(32.19,8.01) v1(32.51,20.07) v1(32.47,15.34) v1(33.02,23.76) v1(33.32,12.85) v1(33.27,11.46) v1(33.66,21.09) v1(33.81,20.07) v1(34.29,21.73) v1(34.54,25.15) v1(34.67,39.12) v1(35.05,22.49) v1(35.18,30.87) v1(35.31,30.23) v1(35.28,1.16) v1(35.43,25.66) v1(35.43,12.84) v1(35.43,11.44) v1(35.56,40.14) v1(35.94,23.5) v1(36.01,30.23) v1(36.45,41.16) v1(36.78,30.23) v1(36.83,24.14) v1(36.96,2.42) v1(37.55,12.84) v1(37.57,42.17) v1(37.59,11.44) v1(38.73,18.55) v1(38.73,15.76) v1(39.75,1.41) v1(39.88,53.09) v1(39.88,51.61) v1(40.36,40.78) v1(40.53,29.12) v1(40.53,27.9) v1(40.53,26.71) v1(41.02,53.09) v1(41.14,12.96) v1(41.15,29.98) v1(41.16,11.44) v1(41.4,40.78) v1(41.53,35.06) v1(41.45,15.76) v1(41.6,29.12) v1(41.6,27.92) v1(41.66,39.76) v1(41.67,26.78) v1(42.29,53.09) v1(42.29,51.59) v1(42.63,40.78) v1(42.67,29.09) v1(42.67,27.93) v1(42.67,26.75) v1(42.72,2.42) v1(42.8,35.06) v1(42.94,39.71) v1(43.05,12.96) v1(43.05,11.44) v1(43.64,29.98) v1(43.64,28.91) v1(43.64,27.68) v1(43.69,26.68) v1(43.79,40.78) v1(44.22,1.41) v1(44.7,18.33) v1(44.89,11.44) v1(44.98,40.78) v1(44.99,12.96) v1(45.72,50.17) v1(45.72,18.68) v1(45.85,19.82) v1(46.76,50.17) v1(46.86,19.57) v1(50.14,33.28) v1(50.8,31) v1(50.76,29.96) v1(50.93,28.57) v1(51.56,31) v1(51.61,29.96) v1(51.94,1.66) v1(52.15,28.57) v1(52.64,15.72) v1(52.96,18.8) v1(53.47,17.92) v1(53.47,16.64) v1(53.47,8.26) v1(53.59,46.36) v1(53.59,45.33) v1(54.36,1.66) v1(54.48,3.82) v1(54.74,20.58) v1(54.86,48.01) v1(55.5,10.42) v1(55.5,8.9) v1(55.63,50.17) v1(55.63,49.36) v1(55.63,33.03) v1(55.63,30.68) v1(55.94,48.01) v1(56.26,29.22) v1(56.26,20.58) v1(56.26,16.9)
ADC1: length 20.8
  Top Layer w0.254: T1.2 26.72,35.06 32.39,35.06 32.89,34.55 32.89,33.16 32.07,32.33 32.07,29.41 32.89,28.58 32.89,27.71 33.8,26.81 33.8,26.55 36.07,26.55 36.47,26.95 U1.38
ADC2: length 21.3
  Top Layer w0.254: U1.39 37.46,26.55 28.7,17.79 R5.2 28.56,17.53 23.75,17.53 22.16,15.94 21.59,15.94
BOOT: length 2.8
  Top Layer w0.254: R11.2 54.1,32.53 SW2.2
C+: length 5.4
  Bottom Layer w2.5: NOREF.1 5.46,10.17 CON2.1
C-: length 63.7
  Top Layer w1.5: CON1.2 6.1,33.92 6.1,52.45 4.22,54.32 U4.1
  Bottom Layer w0.254: R17.1 8.8,54.32 U4.1
  Bottom Layer w2.5: CON1.2 5.97,33.41 9.65,29.73 9.65,5.95 7.65,3.95 5.21,3.95 NOREF#2.2
D+: length 3.7
  Top Layer w0.254: 40.55,24.52 40.55,21.81 R15.2
D-: length 3.7
  Top Layer w0.254: 40.14,24.52 40.13,24.51 40.13,21.72 R14.2
DN: length 15.1
  Top Layer w0.254: R14.1 40.13,18.94 40.13,14.61 39.07,13.55 39.07,7.89 USB1.B7 39.07,7.75 39.07,7.05 39.24,6.89 39.77,6.89 39.93,7.05 39.93,7.75 USB1.A7
DP: length 15
  Top Layer w0.254: R15.1 41.16,19.57 40.54,18.96 40.54,14.44 39.52,13.43 39.52,7.91 ; 39.52,7.91 39.57,7.96 39.57,8.58 39.74,8.75 40.27,8.75 40.43,8.58 40.43,7.89 USB1.B6 ; 39.52,7.91 39.52,7.84 USB1.A6
N: length 43.8
  Top Layer w0.254: T1.4 14.3,19.95 CON2.2
  Top Layer w1: 5.08,28.33 CON1.1
  Top Layer w1.5: 5.08,28.33 1.52,31.89 1.52,47.13 U4.2
  Top Layer w2.5: 5.59,19.95 5.46,20.07 5.46,27.95 5.08,28.33
RESET: length 34.3
  Top Layer w0.254: v1(36.7,31.25) 37.85,31.25 38.73,32.14 39.48,32.14 39.71,31.91 39.71,31.39 U1.26 ; v1(49.91,44.97) 50.16,45.21 R9.2 50.16,49.42 49.91,49.67
  Bottom Layer w0.254: v1(49.91,44.97) 49.91,44.59 47.12,41.79 39.24,41.79 35.18,37.73 35.18,32.27 36.2,31.25 v1(36.7,31.25)
RX: length 21.3
  Top Layer w0.254: 44.95,26.15 45.57,26.15 46.1,26.68 v1(46.1,28.2)
  Bottom Layer w0.254: 55.37,41.16 53.47,39.25 50.67,39.25 46.1,34.68 v1(46.1,28.2)
TX: length 20.2
  Top Layer w0.254: v1(46.74,27.69) 46.74,26.68 45.81,25.75 44.95,25.75
  Bottom Layer w0.254: v1(46.74,27.69) 46.74,34.3 51.05,38.62 H1.1
$1N2110: length 30
  Top Layer w0.254: C1.2 30.13,39.12 R4.2 27.32,37.61 R3.1 26.81,37.61 24.51,35.31 24.51,33.41 25.78,32.14 28.7,32.14 ; 31.74,33.68 30.24,33.68 28.7,32.14 ; T1.1 26.08,29.52 28.7,32.14
$1N2168: length 20
  Top Layer w0.254: 21.59,4.14 21.59,8.64 26.29,13.34 28.69,13.34 C2.2 ; C2.2 R5.1 ; C2.2 30.8,13.33 R7.2 31.11,13.64 31.11,15.51
$1N2640: length 9.2
  Top Layer w0.254: v1(10.41,38.49) 12.18,38.49 16.08,34.59 T1.3
  Bottom Layer w0.254: R20.2 9.62,39.28 v1(10.41,38.49)
$1N4344: length 7.4
  Top Layer w0.254: U2.6 47.37,21.47 46.74,21.47 45.31,22.9 43.64,22.9 42.55,23.98 42.55,24.5 U1.52
$1N4350: length 14.3
  Top Layer w0.254: v1(51.44,21.73) 53.68,21.73 U2.1 ; U1.56 45.47,24.52 45.97,25.03 46.99,25.03 47.12,25.15 v1(48.26,25.15)
  Bottom Layer w0.254: v1(48.26,25.15) 48.89,25.15 51.26,22.79 51.26,21.9 v1(51.44,21.73)
$1N4357: length 9
  Top Layer w0.254: U1.51 42.15,24.5 42.15,23.77 43.43,22.49 44.96,22.49 47.12,20.33 47.96,20.33 U2.7
$1N4376: length 8.4
  Top Layer w0.254: v1(46.04,23.31) 46.1,23.25 U2.5 ; U1.53 42.93,25.66 42.93,25.66 v1(42.67,25.66)
  Bottom Layer w0.254: v1(42.67,25.66) 42.42,25.66 42.16,25.41 42.16,25.03 43.88,23.31 v1(46.04,23.31)
$1N4384: length 25.6
  Top Layer w0.254: U1.55 v1(43.73,25.54) ; R10.1 R11.1 52.21,30.35 55.88,26.68 55.88,25.28 55.2,24.6 U2.2 53.09,22.87 v1(50.04,22.87)
  Bottom Layer w0.254: v1(50.04,22.87) 48.51,24.39 44.96,24.39 43.82,25.54 v1(43.73,25.54)
$1N4395: length 12.7
  Top Layer w0.254: U2.3 53.01,24.52 46.36,24.52 45.21,23.38 43.82,23.38 43.35,23.84 43.35,24.5 U1.54
$1N5832: length 9.8
  Top Layer w0.254: U1.20 42.13,33.12 45.4,36.39 45.4,36.72 45.45,36.77 C15.2 44.04,38.32 X1.3
$1N5887: length 4.9
  Top Layer w0.254: X1.1 39.72,38.09 R8.2 38.94,38.05 36.96,38.05
$1N5892: length 6.6
  Top Layer w0.254: U1.21 41.73,33.21 38.86,36.08 38.86,36.83
$1N6778: length 11.7
  Top Layer w0.254: R12.2 45.97,4.44 v1(45.97,6.87) ; USB1.B5 41.5,9.76 v1(41.91,10.17)
  Bottom Layer w0.254: v1(45.97,6.87) 45.97,8.9 44.7,10.17 v1(41.91,10.17)
$1N6817: length 11.9
  Top Layer w0.254: USB1.A5 38.5,9.51 v1(37.97,10.04) ; R13.1 33.4,4.32 v1(33.4,5.85)
  Bottom Layer w0.254: v1(37.97,10.04) 35.18,10.04 33.4,8.26 v1(33.4,5.85)
$1N7231: length 10.8
  Top Layer w0.8: U3.3 51.83,14.37 50.93,13.47 50.93,8.73 D3.1
$1N11564: length 3.1
  Top Layer w0.254: LED1.1 48.26,52.87 R16.2
$1N14955: length 1.7
  Bottom Layer w0.254: R17.2 R18.1
$1N14994: length 1.9
  Bottom Layer w0.254: R18.2 R19.1
$1N15033: length 1.9
  Bottom Layer w0.254: R19.2 R20.1

## Copper pours and planes (outline as drawn; the poured copper is in the pictures)
3.3V on Top Layer: 40.93,23.41 40.83,23.31 42.29,21.85 42.29,20.84 42.55,20.58 43.31,20.58 43.31,21.47 41.53,23.25 41.53,24.77 41.4,24.9 40.93,24.9
3.3V on Top Layer: 43.94,17.58 43.94,16.67 47.71,16.67 48.5,15.88 50.55,15.88 50.67,16.01 50.67,18.33 51.05,18.71 51.05,19.57 51.11,19.63 50.25,20.76 50.04,20.96 48.26,19.82 45.67,17.58
3.3V on Top Layer: 30.23,17.79 30.23,16.65 30.35,16.52 33.86,16.52 33.86,17.56 33.63,17.79
3.3V on Top Layer: 32.13,42.93 47.37,42.93 47.75,43.32 47.75,46.62 47.5,46.87 32.51,46.87 32.13,46.49
3.3V on Top Layer: 31.24,19.06 31.24,16.65 31.37,16.52 34.54,16.52 34.67,16.65 34.67,18.8 34.42,19.06
3.3V on Top Layer: 34.98,16.67 38.61,16.67 38.61,17.92 36.45,17.92 36.45,21.34 38.99,23.88 39.37,23.88 39.5,24.01 39.5,24.97 39.01,24.97 38.93,25.05 38.93,24.71 34.98,20.96
3.3V on Top Layer: 32.39,17.53 32.87,17.04 32.87,16.54 36.56,16.54 36.69,16.67 36.69,17.67 36.58,17.79 33.27,17.79 33.15,17.66 32.51,17.66
3.3V on Top Layer: 48.13,18.3 46.36,16.52 46.36,10.42 46.61,10.17 49.43,10.17 49.43,14.97 49.28,15.12 49.81,15.65 50.8,15.65 50.8,18.09 50.59,18.3
3.3V on Top Layer: 42.55,21.09 42.22,20.76 42.22,16.59 42.29,16.52 45.54,16.52 45.7,16.67 45.7,17.66 45.21,17.66 43.33,17.78 43.31,21.73 42.42,21.73 42.42,21.22
3.3V on Bottom Layer: 47.5,25.98 49.18,25.98 49.18,33.32 47.5,33.32
GND on Top Layer: 22.1,62.75 22.1,-5.07 22.48,-5.45 59.82,-5.45 61.34,-3.93 61.34,61.1 59.44,63 22.35,63
GND on Bottom Layer: 22.73,63.25 22.73,0.01 22.23,-0.5 59.05,-0.5 60.2,0.64 60.2,63.76 59.56,64.4 23.88,64.4

## Text on the board
Bottom Silkscreen Layer: Open Hardware | Designed by Dwan
Top Silkscreen Layer: GND | 3.3V | RX | TX | BOOT | RST
